# EAGLE design AIR (EAGLE 7.2.0)
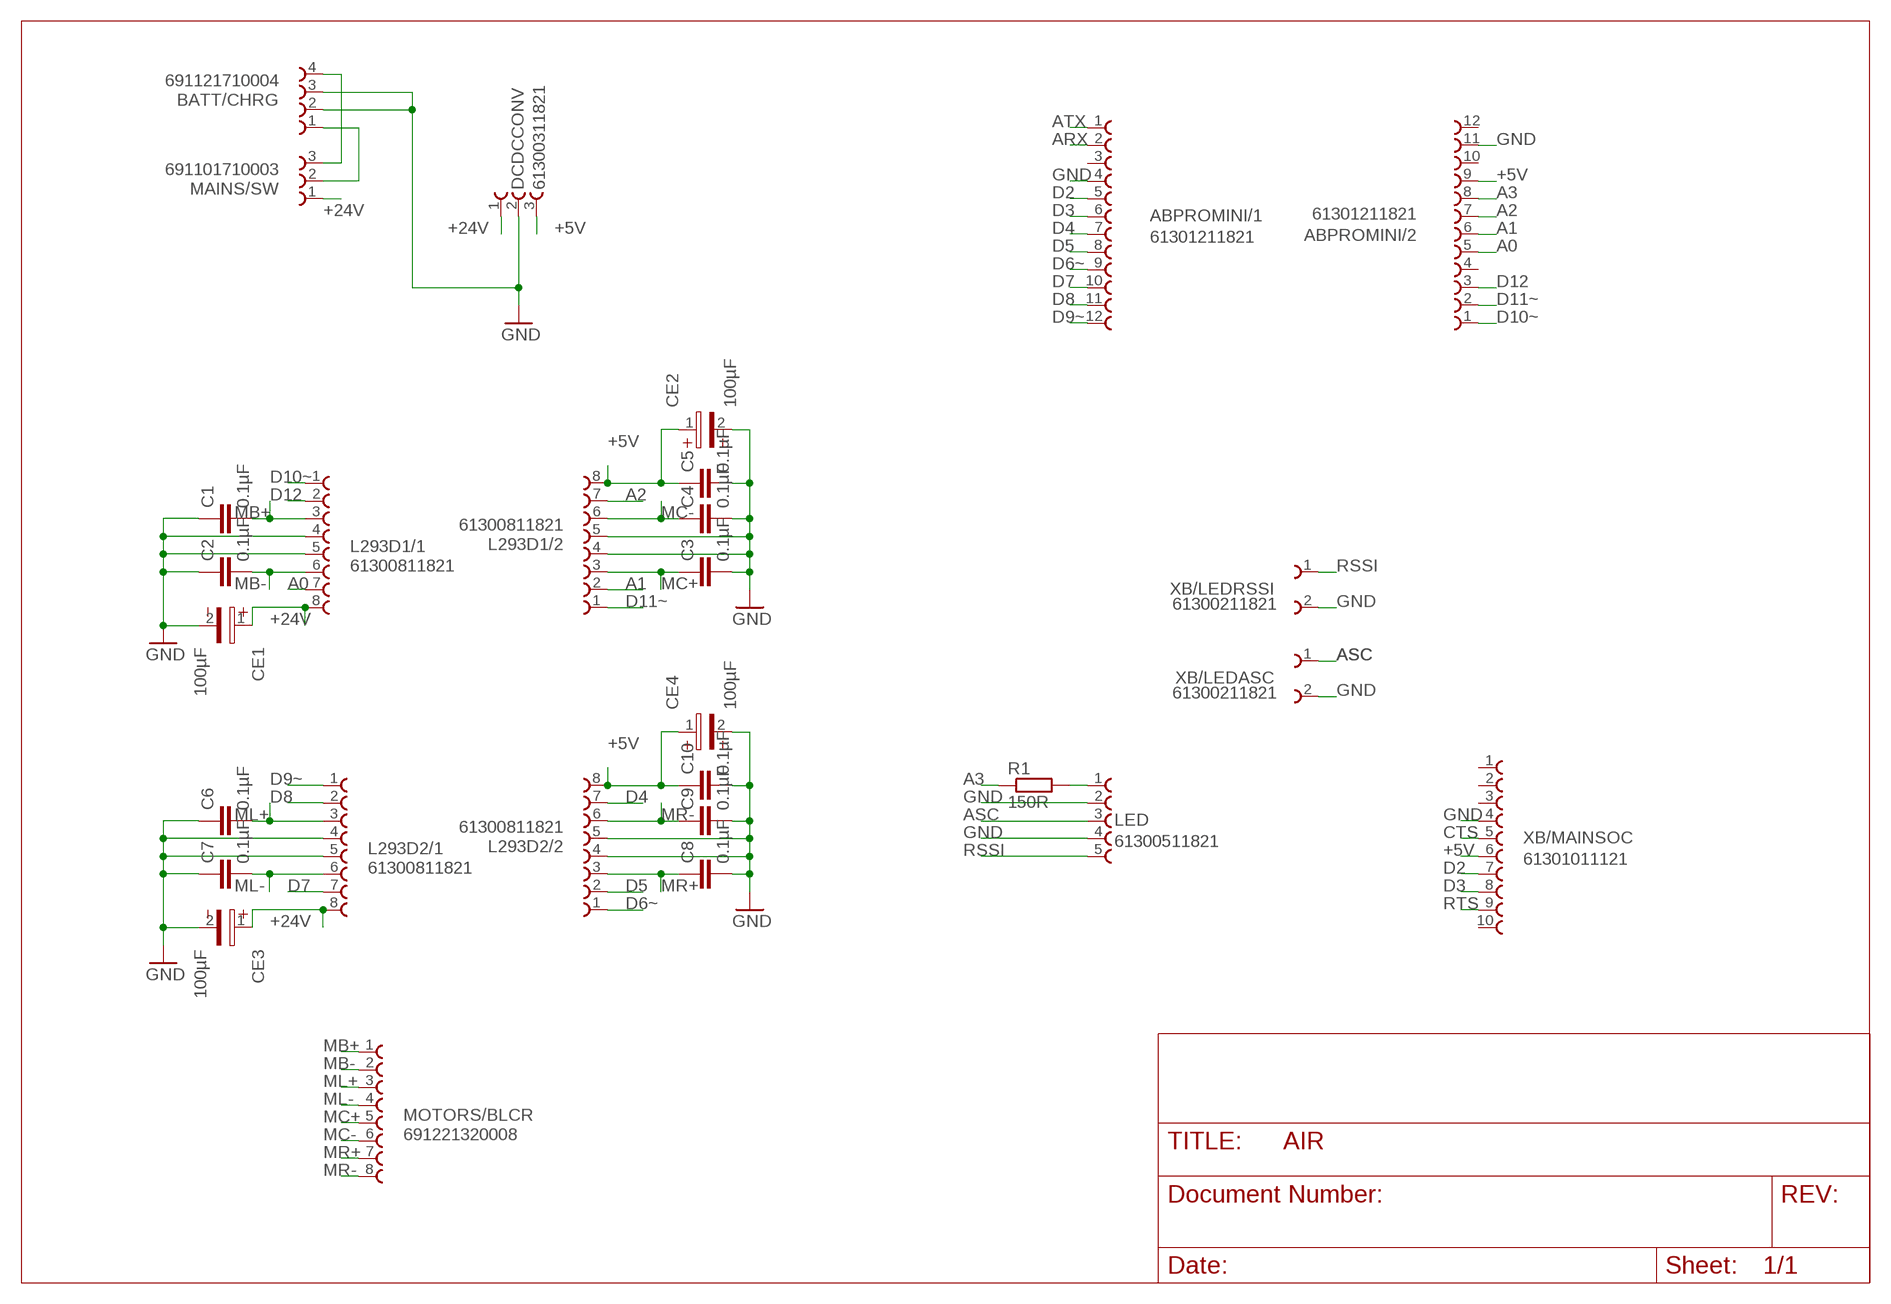
[diagram p0: schematic, sheet 1]

## Parts
ABPROMINI/1  61301211821  [61301211821]
ABPROMINI/2  61301211821  [61301211821]
BATT/CHRG  691121710004  [691121710004]
C1  0.1µF  C-EU025-025X050  [C025-025X050]
C2  0.1µF  C-EU025-025X050  [C025-025X050]
C3  0.1µF  C-EU025-025X050  [C025-025X050]
C4  0.1µF  C-EU025-025X050  [C025-025X050]
C5  0.1µF  C-EU025-025X050  [C025-025X050]
C6  0.1µF  C-EU025-025X050  [C025-025X050]
C7  0.1µF  C-EU025-025X050  [C025-025X050]
C8  0.1µF  C-EU025-025X050  [C025-025X050]
C9  0.1µF  C-EU025-025X050  [C025-025X050]
C10  0.1µF  C-EU025-025X050  [C025-025X050]
CE1  100µF  WCAP-PTG5_8X8X3.5X0.6(DXLXPXØ)  [8X3.5X0.9(DXAXB)]
CE2  100µF  WCAP-PTG5_8X8X3.5X0.6(DXLXPXØ)  [8X3.5X0.9(DXAXB)]
CE3  100µF  WCAP-PTG5_8X8X3.5X0.6(DXLXPXØ)  [8X3.5X0.9(DXAXB)]
CE4  100µF  WCAP-PTG5_8X8X3.5X0.6(DXLXPXØ)  [8X3.5X0.9(DXAXB)]
DCDCCONV  61300311821  [61300311821]
L293D1/1  61300811821  [61300811821]
L293D1/2  61300811821  [61300811821]
L293D2/1  61300811821  [61300811821]
L293D2/2  61300811821  [61300811821]
LED  61300511821  [61300511821]
MAINS/SW  691101710003  [691101710003]
MOTORS/BLCR  691221320008  [691221320008]
R1  150R  R-EU_0204/7  [0204/7]
XB/LEDASC  61300211821  [61300211821]
XB/LEDRSSI  61300211821  [61300211821]
XB/MAINSOC  61301011121  [61301011121]

## Nets
+5V: ABPROMINI/2.9 C5.1 C10.1 CE2.1 CE4.1 DCDCCONV.3 L293D1/2.8 L293D2/2.8 XB/MAINSOC.6
+24V: CE1.1 CE3.1 DCDCCONV.1 L293D1/1.8 L293D2/1.8 MAINS/SW.1
A0: ABPROMINI/2.5 L293D1/1.7
A1: ABPROMINI/2.6 L293D1/2.2
A2: ABPROMINI/2.7 L293D1/2.7
A3: ABPROMINI/2.8 R1.1
ARX: ABPROMINI/1.2
ASC: LED.3 XB/LEDASC.1
ATX: ABPROMINI/1.1
CTS: XB/MAINSOC.5
D2: ABPROMINI/1.5 XB/MAINSOC.7
D3: ABPROMINI/1.6 XB/MAINSOC.8
D4: ABPROMINI/1.7 L293D2/2.7
D5: ABPROMINI/1.8 L293D2/2.2
D6~: ABPROMINI/1.9 L293D2/2.1
D7: ABPROMINI/1.10 L293D2/1.7
D8: ABPROMINI/1.11 L293D2/1.2
D9~: ABPROMINI/1.12 L293D2/1.1
D10~: ABPROMINI/2.1 L293D1/1.1
D11~: ABPROMINI/2.2 L293D1/2.1
D12: ABPROMINI/2.3 L293D1/1.2
GND [power]: ABPROMINI/1.4 ABPROMINI/2.11 BATT/CHRG.2 BATT/CHRG.3 C1.1 C2.1 C3.2 C4.2 C5.2 C6.1 C7.1 C8.2 C9.2 C10.2 CE1.2 CE2.2 CE3.2 CE4.2 DCDCCONV.2 L293D1/1.4 L293D1/1.5 L293D1/2.4 L293D1/2.5 L293D2/1.4 L293D2/1.5 L293D2/2.4 L293D2/2.5 LED.2 LED.4 XB/LEDASC.2 XB/LEDRSSI.2 XB/MAINSOC.4
MB+: C1.2 L293D1/1.3 MOTORS/BLCR.1
MB-: C2.2 L293D1/1.6 MOTORS/BLCR.2
MC+: C3.1 L293D1/2.3 MOTORS/BLCR.5
MC-: C4.1 L293D1/2.6 MOTORS/BLCR.6
ML+: C6.2 L293D2/1.3 MOTORS/BLCR.3
ML-: C7.2 L293D2/1.6 MOTORS/BLCR.4
MR+: C8.1 L293D2/2.3 MOTORS/BLCR.7
MR-: C9.1 L293D2/2.6 MOTORS/BLCR.8
N$1: LED.1 R1.2
N$3: BATT/CHRG.1 MAINS/SW.2
N$4: BATT/CHRG.4 MAINS/SW.3
RSSI: LED.5 XB/LEDRSSI.1
RTS: XB/MAINSOC.9
Unconnected: ABPROMINI/1.3 ABPROMINI/2.4 ABPROMINI/2.10 ABPROMINI/2.12 XB/MAINSOC.1 XB/MAINSOC.2 XB/MAINSOC.3 XB/MAINSOC.10

## Library data of the parts
ABPROMINI/1 ABPROMINI/2 = Wurth_Elektronik_Electromechanic_Board_to_Board_Connectors_rev15b:61301211821: WR-PHD 2.54mm Socket Header, 12 Pins =>Code : Con_BTB_SHD_2.54_1_THT_61301211821 <http://katalog.we-online.de/media/images/eican/Con_BTB_SHD_2.54_1_THT_6130xx11821_pf2.jpg> Details see: http://katalog.we-online.de/en/em/613_0xx_118_21 Created 2014-05-29, Karrer Zheng 2014 (C) Würth Elektronik
BATT/CHRG = Wurth_Elektronik_Electromechanic_Terminal_Blocks_Connectors_rev15b:691121710004: WR-TBL Serie 121 - 5.0mm Horizontal Entry Modular With Pressure Clamp - 3.3mm2 Wires, 4 Pins
C1-C10 = rcl:C-EU: CAPACITOR, European symbol
CE1-CE4 = Eagle_Wurth_Elektronik_Passive_Capacitors_rev15a:WCAP-PTG5: WCAP-PTG5 Aluminum Polymer Capacitors Characteristics Aluminum Polymer Capacitor Recommended soldering: Wave Operating temperature: -55°C to +105°C Low ESR at high frequency range High permissible ripple current Load life: 2000h @ +105°C Package name and Variant abbreviation: Package: D X A X B = Diameter of the outline X Pitch of the hole X Diameter of the hole. Variant: D X L X P X Ø = Diameter of the body part X Height of the body part X Pitch of the pin X Diameter of the pin. <http://katalog.we-online.de/media/images/eisos/WCAP-PTG5_pf2.jpg> Details see: http://katalog.we-online.de/en/pbs/WCAP-PTG5/ Created: 2015-02-06 2015 (C) Wurth Elektronik
DCDCCONV = Wurth_Elektronik_Electromechanic_Board_to_Board_Connectors_rev15b:61300311821: WR-PHD 2.54mm Socket Header, 3 Pins =>Code : Con_BTB_SHD_2.54_1_THT_61300311821 <http://katalog.we-online.de/media/images/eican/Con_BTB_SHD_2.54_1_THT_6130xx11821_pf2.jpg> Details see: http://katalog.we-online.de/en/em/613_0xx_118_21 Created 2014-05-29, Karrer Zheng 2014 (C) Würth Elektronik
L293D1/1 L293D1/2 L293D2/1 L293D2/2 = Wurth_Elektronik_Electromechanic_Board_to_Board_Connectors_rev15b:61300811821: WR-PHD 2.54mm Socket Header, 8 Pins =>Code : Con_BTB_SHD_2.54_1_THT_61300811821 <http://katalog.we-online.de/media/images/eican/Con_BTB_SHD_2.54_1_THT_6130xx11821_pf2.jpg> Details see: http://katalog.we-online.de/en/em/613_0xx_118_21 Created 2014-05-29, Karrer Zheng 2014 (C) Würth Elektronik
LED = Wurth_Elektronik_Electromechanic_Board_to_Board_Connectors_rev15b:61300511821: WR-PHD 2.54mm Socket Header, 5 Pins =>Code : Con_BTB_SHD_2.54_1_THT_61300511821 <http://katalog.we-online.de/media/images/eican/Con_BTB_SHD_2.54_1_THT_6130xx11821_pf2.jpg> Details see: http://katalog.we-online.de/en/em/613_0xx_118_21 Created 2014-05-29, Karrer Zheng 2014 (C) Würth Elektronik
MAINS/SW = Wurth_Elektronik_Electromechanic_Terminal_Blocks_Connectors_rev15b:691101710003: WR-TBL Serie 101 - 5.0mm HOrizontal Entry Modular with Pressure Clamp - 2.5mm2 Wires , 3 pins=>Code : Con-TBL_Screw_PressureClamp_691101710003 <http://katalog.we-online.de/media/images/eican/Con-TBL_Screw_PressureClamp_6911017100xx_pf2.jpg> Details see: http://katalog.we-online.de/en/em/691_101_710_0xx Created 2014-06-17, Karrer Zheng 2014 (C) Würth Elektronik
MOTORS/BLCR = Wurth_Elektronik_Electromechanic_Terminal_Blocks_Connectors_rev15b:691221320008: WR-TBL Serie 2213 - 3.81mm 45° Entry Modular with Rising Cage Clamp - 1.3mm2 Wires, 8 Pins=>Code : Con_TBL_Screw_RisingClamp_3.81_691221320008 <http://katalog.we-online.de/media/images/eican/Con_TBL_Screw_RisingClamp_3.81_6912213200xx_pf2.jpg> Details see: http://katalog.we-online.de/en/em/691_221_320_0xx Created 2014-06-18, Karrer Zheng 2014 (C) Würth Elektronik
R1 = resistor:R-EU_: RESISTOR, European symbol
XB/LEDASC XB/LEDRSSI = Wurth_Elektronik_Electromechanic_Board_to_Board_Connectors_rev15b:61300211821: WR-PHD 2.54mm Socket Header, 2 Pins =>Code : Con_BTB_SHD_2.54_1_THT_61300211821 <http://katalog.we-online.de/media/images/eican/Con_BTB_SHD_2.54_1_THT_6130xx11821_pf2.jpg> Details see: http://katalog.we-online.de/en/em/613_0xx_118_21 Created 2014-05-29, Karrer Zheng 2014 (C) Würth Elektronik
XB/MAINSOC = Wurth_Elektronik_Electromechanic_Board_to_Board_Connectors_rev15b:61301011121: WR-PHD 2.54mm Pin Header, 10 Pins =>Code : Con_BTB_PHD_2.54_1_THT_61301011121 <http://katalog.we-online.de/media/images/eican/Con_BTB_PHD_2.54_1_THT_6130xx11121_pf2.jpg> Details see: http://katalog.we-online.de/en/em/613_0xx_111_21 Created 2014-05-29, Karrer Zheng 2014 (C) Würth Elektronik

## Net classes
0 default: width 0.3 mm, drill 0.6 mm, clearance 0.2 mm
1 power: width 0.4 mm, drill 0.6 mm, clearance 0.2 mm

## Board
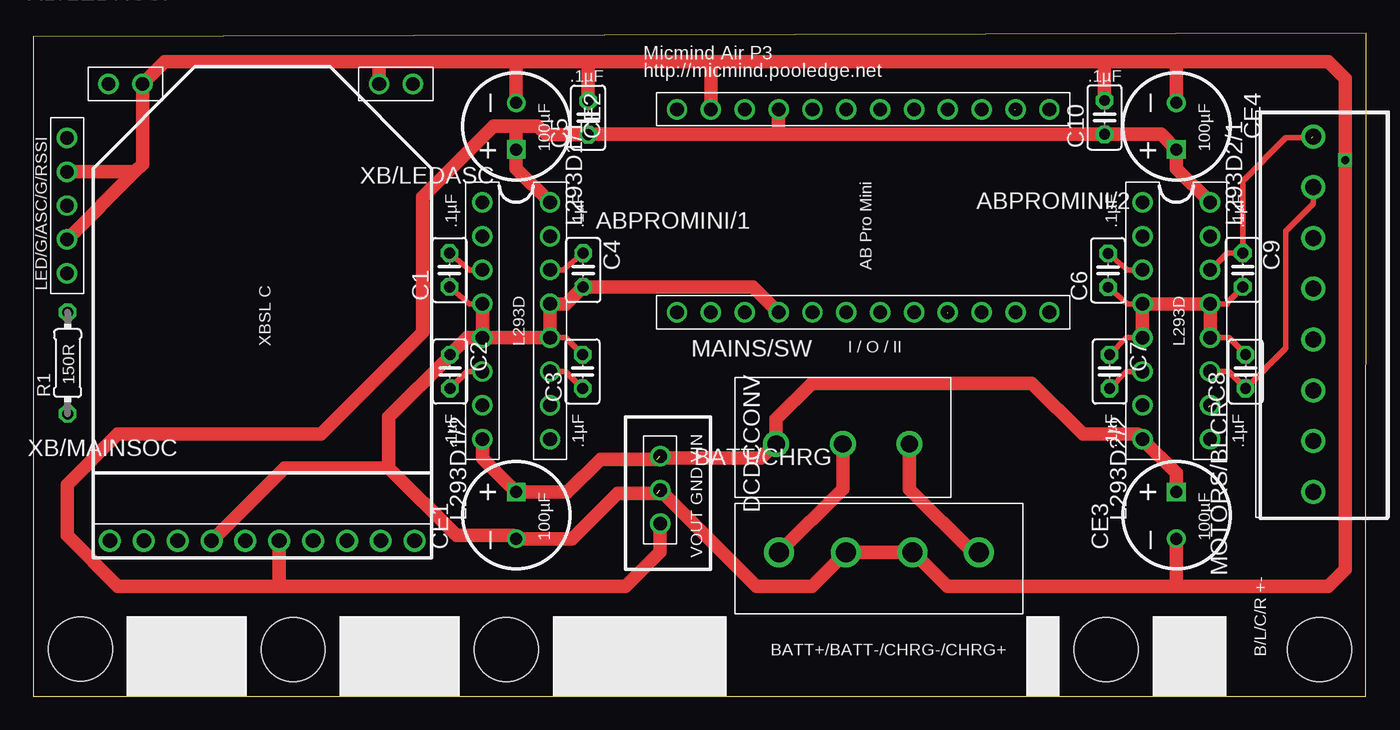
[diagram p1: board, top side]
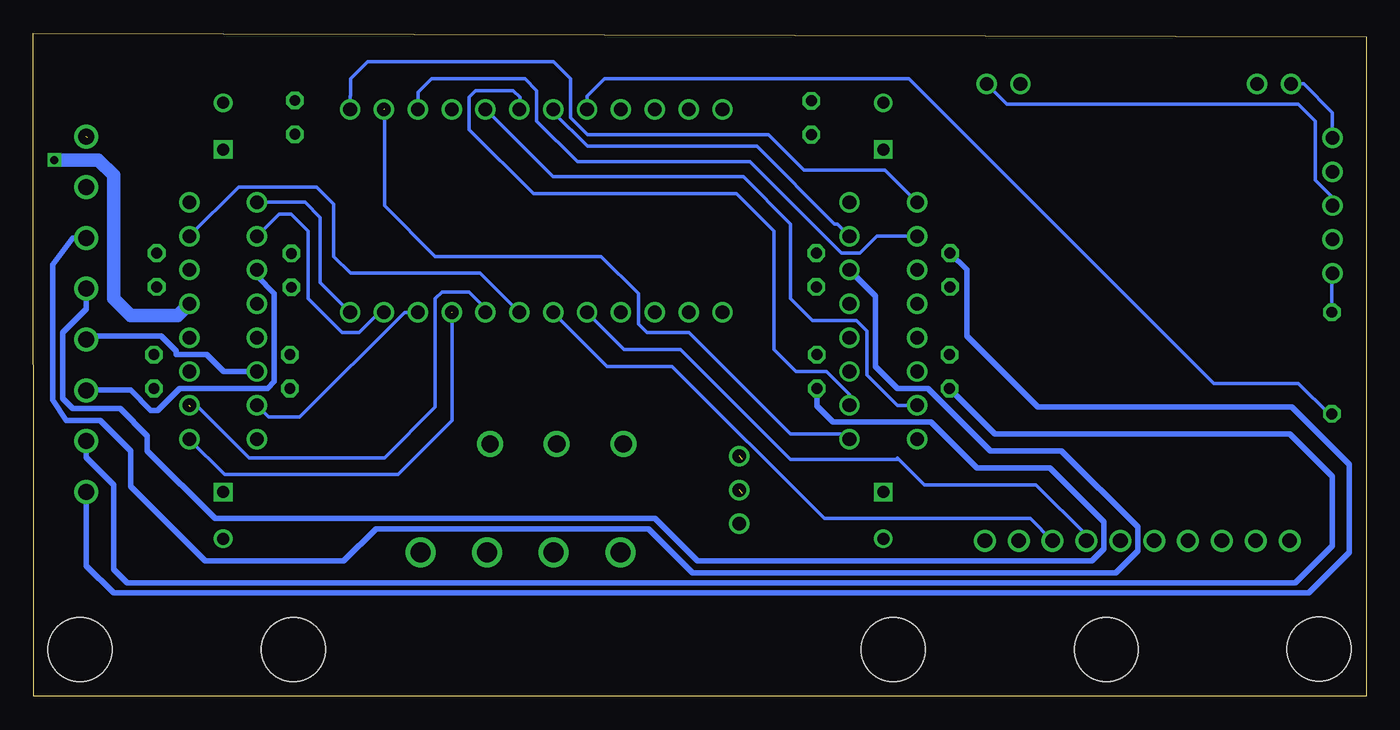
[diagram p2: board, bottom side, seen from below]

Size 100 x 49.76 mm. Coordinates in mm from the lower left corner, seen from the top.
Outline: 0,0 99.97,0 100,49.76 0,49.52 0,0
Copper layers (1*16): Top 0.035mm / dielectric 1.5mm / Bottom 0.035mm
Design rules "default *": minimum track width 0.15mm, minimum drill 0.25mm, track to track 8mil, track to pad 8mil, pad to pad 8mil, via to via 8mil, smd to smd 8mil, copper to edge 40mil, drill to drill 8mil, minimum pad ring 10mil, minimum via ring 8mil, stop-mask expansion 4mil, vias tented up to drill 0mil, thermal gap 10mil
Holes 4.8 mm at 3.54,3.54 19.5,3.5 35.5,3.5 96.5,3.5 80.5,3.5

### Footprints (pad centres in the part's own frame; a part is rotated, then mirrored left to right if it is on the bottom)
61301211821 = drill 1.02: 1 -13.97,0; 2 -11.43,0; 3 -8.89,0; 4 -6.35,0; 5 -3.81,0; 6 -1.27,0; 7 1.27,0; 8 3.81,0; 9 6.35,0; 10 8.89,0; 11 11.43,0; 12 13.97,0
691121710004 = drill 1.5: 1 -5,0; 2 0,0; 3 5,0; 4 10,0
C025-025X050 = drill 0.813 octagon: 1 -1.27,0; 2 1.27,0
8X3.5X0.9(DXAXB) = drill 0.9 square: 1 1.75,0 | drill 0.9: 2 -1.75,0
61300311821 = drill 1.02: 1 -2.54,0; 2 0,0; 3 2.54,0
61300811821 = drill 1.02: 1 -8.89,0; 2 -6.35,0; 3 -3.81,0; 4 -1.27,0; 5 1.27,0; 6 3.81,0; 7 6.35,0; 8 8.89,0
61300511821 = drill 1.02: 1 -5.08,0; 2 -2.54,0; 3 0,0; 4 2.54,0; 5 5.08,0
691101710003 = drill 1.3: 1 -5,0; 2 0,0; 3 5,0
691221320008 = drill 1.2: 1 -3.81,0; 2 0,0; 3 3.81,0; 4 7.62,0; 5 11.43,0; 6 15.24,0; 7 19.05,0; 8 22.86,0
0204/7 = drill 0.813 octagon: 1 -3.81,0; 2 3.81,0
61300211821 = drill 1.02: 1 -1.27,0; 2 1.27,0
61301011121 = drill 1.1: 1 -11.43,0; 2 -8.89,0; 3 -6.35,0; 4 -3.81,0; 5 -1.27,0; 6 1.27,0; 7 3.81,0; 8 6.35,0; 9 8.89,0; 10 11.43,0

### Placement (x,y rotation side)
ABPROMINI/1  62.27,28.82 0 top
ABPROMINI/2  62.27,44.06 180 top
BATT/CHRG  60.96,10.79 0 top
C1  31.22,32 90 top
C2  31.26,24.38 270 top
C3  41.21,24.38 90 top
C4  41.26,32 270 top
C5  41.63,43.42 90 top
C6  80.64,31.97 90 top
C7  80.75,24.38 270 top
C8  90.96,24.38 90 top
C9  90.75,32 270 top
C10  80.38,43.45 90 top
CE1  36.23,13.58 90 top
CE2  36.23,42.79 270 top
CE3  85.76,13.58 90 top
CE4  85.76,42.79 270 top
DCDCCONV  47.02,15.48 270 top
L293D1/1  33.69,28.18 270 top
L293D1/2  38.77,28.18 90 top
L293D2/1  83.22,28.18 270 top
L293D2/2  88.3,28.18 90 top
LED  2.54,36.83 90 top
MAINS/SW  60.73,18.94 0 top
MOTORS/BLCR  96.03,19.16 90 top
R1  2.58,25.01 90 top
XB/LEDASC  27.21,45.97 180 top
XB/LEDRSSI  6.92,45.97 0 top
XB/MAINSOC  17.18,11.68 0 top

### Tracks (layer width: path | path; a pad name or v marks a point on that pad's centre or on a via)
+5V
  Top 0.406: 41.65,42.18 C5.1
  Top 1.016: DCDCCONV.3 47.02,10.83 44.45,8.26 18.41,8.26 | 18.41,8.26 6.35,8.26 2.54,12.06 2.54,15.88 6.35,19.68 21.59,19.68 29.21,27.3 29.21,37.47 34.54,42.8 36.32,42.8 | 41.65,42.18 55.88,42.18 | 55.88,42.18 C10.1 84.62,42.18 CE4.1 85.76,39.62 L293D2/2.8 | XB/MAINSOC.6 18.45,8.29 18.41,8.26 | C5.1 38.49,42.16 37.85,42.8 36.32,42.8 | 36.32,42.8 36.23,42.71 CE2.1 36.23,39.62 L293D1/2.8 | ABPROMINI/2.9 55.91,42.22 55.88,42.18
+24V  (1 unrouted)
  Top 1.016: L293D1/1.8 33.69,17.87 CE1.1 40.09,15.33 42.55,17.78 46.78,17.78 | CE3.1 85.76,16.75 L293D2/1.8 82.83,19.68 78.74,19.68 74.93,23.5 58.42,23.5 55.73,20.81 MAINS/SW.1 55.64,18.94 54.61,17.91 47.14,17.91 DCDCCONV.1
A0
  Bottom 0.254: L293D1/1.7 35.17,21.84 37.47,24.13 37.47,27.43 38.23,28.19 41.53,28.19 43.18,29.84 43.18,35.43 46.74,38.99 61,38.99 ABPROMINI/2.5
A1
  Bottom 0.254: L293D1/2.2 38.77,22.64 40.51,24.38 42.8,24.38 44.45,26.04 44.45,34.92 47.24,37.72 62.48,37.72 67.31,42.55 67.31,44.96 66.8,45.47 64.01,45.47 63.5,44.96 63.5,44.09 ABPROMINI/2.6
A2
  Bottom 0.254: ABPROMINI/2.7 60.99,43.85 58.42,41.27 45.72,41.27 39.88,35.43 39.67,35.43 L293D1/2.7
A3
  Bottom 0.254: R1.1 2.79,21.2 5.08,23.5 11.43,23.5 34.29,46.35 57.15,46.35 58.45,45.05 ABPROMINI/2.8
ASC
  Bottom 0.254: LED.3 2.54,37.47 3.81,38.73 3.81,43.18 5.08,44.45 26.97,44.45 XB/LEDASC.1
D2
  Bottom 0.254: 35.05,17.78 33.15,15.88 24.77,15.88 20.99,12.1 XB/MAINSOC.7 | 35.05,17.78 35.18,17.91 | ABPROMINI/1.5 55.67,26.04 51.44,26.04 43.18,17.78 35.05,17.78
D3
  Bottom 0.254: XB/MAINSOC.8 25.19,13.34 40.64,13.34 52.07,24.77 56.94,24.77 ABPROMINI/1.6
D4
  Bottom 0.254: L293D2/2.7 84.61,38.23 78.74,38.23 77.47,36.96 77.47,33.02 76.2,31.75 66.47,31.75 ABPROMINI/1.7
D5  (1 unrouted)
  Bottom 0.254: ABPROMINI/1.8 66.08,29.12 67.31,30.35 69.34,30.35 69.85,29.84 69.85,21.72 73.66,17.91 83.82,17.91 87.63,21.72 88.18,21.72
D6~  (1 unrouted)
  Bottom 0.254: 68.58,28.79 68.58,20.7 72.64,16.64 85.64,16.64 L293D2/2.1
D7
  Bottom 0.254: ABPROMINI/1.10 72.14,28.82 80.01,20.95 82.34,20.95 L293D2/1.7
D8
  Bottom 0.254: ABPROMINI/1.11 74.05,28.82 75.56,27.3 76.83,27.3 79.38,29.84 79.38,34.92 80.64,36.2 81.56,36.2 L293D2/1.2
D9~
  Bottom 0.254: L293D2/1.1 79.62,37.08 78.49,35.94 78.49,31.07 ABPROMINI/1.12
D10~
  Bottom 0.254: ABPROMINI/2.1 76.23,45.05 76.2,45.09 76.2,46.35 74.93,47.62 60.96,47.62 59.69,46.35 59.69,43.43 58.42,42.16 44.83,42.16 42.16,39.5 36.11,39.5 L293D1/1.1
D11~  (1 unrouted)
  Bottom 0.254: L293D1/2.1 39.16,19.68 43.18,19.68 50.8,27.3 53.98,27.3 54.61,27.94 54.61,30.23 57.4,33.02 69.85,33.02 73.66,36.83 73.66,44.02
D12
  Bottom 0.254: L293D1/1.2 36.71,34.53 37.97,33.27 39.37,33.27 46.23,40.13 59.18,40.13 62.23,43.18 62.23,45.47 63.12,46.35 70.1,46.35 71.12,45.34 71.12,44.09 ABPROMINI/2.3
GND  (via drill 0.6)  (1 unrouted)
  Top 0.406: L293D1/1.4 32.74,29.45 C1.1 | 90.75,30.63 C9.2 89.57,29.55 89.57,29.45 L293D2/2.5 | L293D2/2.4 89.69,26.91 C8.2 | L293D1/2.4 39.94,26.91 C3.2 | L293D2/1.4 82.11,29.45 C6.1 | L293D2/1.5 82.03,26.91 C7.1 | 41.63,47.34 41.91,47.62 | 50.84,47.59 50.8,47.62 | 80.38,47.26 80.01,47.62
  Top 1.016: 85.72,8.26 68.58,8.26 66.04,10.79 BATT/CHRG.3 BATT/CHRG.2 58.42,8.26 54.26,8.26 DCDCCONV.2 | 85.72,8.26 97.16,8.26 98.42,9.53 v98.42,40.26 98.42,46.35 97.16,47.62 85.72,47.62 | 36.2,47.62 25.91,47.62 | 25.91,47.62 9.85,47.62 XB/LEDRSSI.2 8.19,39.94 7.62,39.37 | 36.2,47.62 41.91,47.62 50.8,47.62 80.01,47.62 85.72,47.62 | 7.62,39.37 LED.2 | LED.4 7.62,39.37 | L293D1/1.5 L293D1/2.4 L293D1/2.5 39.99,29.45 C4.2 54.01,30.73 ABPROMINI/1.4 | L293D1/1.5 32.53,26.91 C2.1 31.26,25.55 26.67,20.95 26.67,17.14 | L293D1/1.5 L293D1/1.4 | L293D2/1.5 L293D2/1.4 L293D2/2.5 L293D2/2.4 | 26.67,17.14 31.75,12.06 35.99,12.06 CE1.2 40.41,11.83 43.81,15.24 46.78,15.24 | 26.67,17.14 18.84,17.14 XB/MAINSOC.4 | CE2.2 36.23,47.59 36.2,47.62 | C5.2 41.63,47.34 | ABPROMINI/2.11 50.84,47.59 | C10.2 80.38,47.26 | CE4.2 85.76,47.59 85.72,47.62 | CE3.2 85.76,8.29 85.72,8.26 | XB/LEDASC.2 25.94,47.59 25.91,47.62
  Bottom 1.016: v98.42,40.26 95.12,40.26 93.98,39.12 93.98,29.84 92.71,28.57 89.18,28.57 L293D2/2.5
MB+
  Top 0.406: L293D1/1.3 32.74,32 C1.2
  Bottom 0.406: MOTORS/BLCR.1 96.03,9.8 93.98,7.75 4.32,7.75 1.27,10.79 1.27,17.4 5.59,21.72 24.64,21.72 29.97,27.05 29.97,32.02 C1.2
MB-
  Top 0.406: L293D1/1.6 32.53,24.38 C2.2
  Bottom 0.406: MOTORS/BLCR.2 96.03,17.93 93.98,15.88 93.98,9.53 92.96,8.51 5.33,8.51 2.54,11.3 2.54,16.51 5.71,19.68 27.84,19.68 C2.2
MC+
  Top 0.406: L293D1/2.3 39.94,24.38 C3.1
  Bottom 0.406: MOTORS/BLCR.5 96.03,29.06 97.79,27.3 97.79,22.35 97.03,21.59 93.47,21.59 91.44,19.56 91.44,18.41 86.36,13.34 53.34,13.34 50.16,10.16 20.57,10.16 19.68,11.05 19.68,13.08 23.75,17.14 29.21,17.14 32.64,20.57 40.01,20.57 41.21,21.78 C3.1
MC-
  Top 0.406: L293D1/2.6 39.73,32 C4.1
  Bottom 0.406: MOTORS/BLCR.6 97.05,34.4 98.55,32.38 98.55,22.23 97.54,20.7 95,20.7 92.71,18.41 92.71,15.75 87.12,10.16 76.71,10.16 74.3,12.57 53.85,12.57 50.55,9.27 18.8,9.27 17.14,10.92 17.14,12.7 22.86,18.41 28.19,18.41 32.89,23.11 35.18,23.11 36.83,24.77 36.83,30.05 L293D1/2.6
ML+
  Top 0.406: L293D2/1.3 82.11,32 C6.2
  Bottom 0.406: L293D2/1.3 83.22,31.53 81.92,30.23 81.92,23.62 82.42,23.11 89.03,23.11 90.68,21.46 91.19,21.46 92.71,22.99 96.02,22.99 MOTORS/BLCR.3
ML-
  Top 0.406: L293D2/1.6 82.03,24.38 C7.2
  Bottom 0.406: L293D2/1.6 85.72,24.38 87,25.65 89.28,25.65 89.28,25.91 90.42,27.05 95.76,27.05 MOTORS/BLCR.4
MR+
  Top 0.406: L293D2/2.3 89.69,24.38 C8.1 93.98,26.13 93.98,34.92 96.03,36.98 MOTORS/BLCR.7
MR-  (1 unrouted)
  Top 0.406: L293D2/2.6 89.57,33.27 C9.1 90.75,38.68 93.98,41.91 95.92,41.91
N$1
  Bottom 0.254: R1.2 2.58,31.71 LED.1
N$3
  Top 1.016: MAINS/SW.2 60.73,15.57 BATT/CHRG.1
N$4
  Top 1.016: MAINS/SW.3 65.73,15.54 70.48,10.79 BATT/CHRG.4
RSSI
  Bottom 0.254: XB/LEDRSSI.1 4.69,45.97 2.54,43.81 LED.5

### Text on the board
tPlace: .1µF | .1µF | Micmind Air P3 / http://micmind.pooledge.net | 100µF | 100µF | + – | + – | .1µF | .1µF | .1µF | .1µF | AB Pro Mini | LED/G/ASC/G/RSSI | I / O / II | XBSL C | L293D | L293D | 150R | .1µF | .1µF | .1µF | .1µF | 100µF | 100µF | – + | – + | VOUT GND VIN | BATT+/BATT-/CHRG-/CHRG+ | B/L/C/R +-